# Altium project USB HUB 2.0.PrjPCB
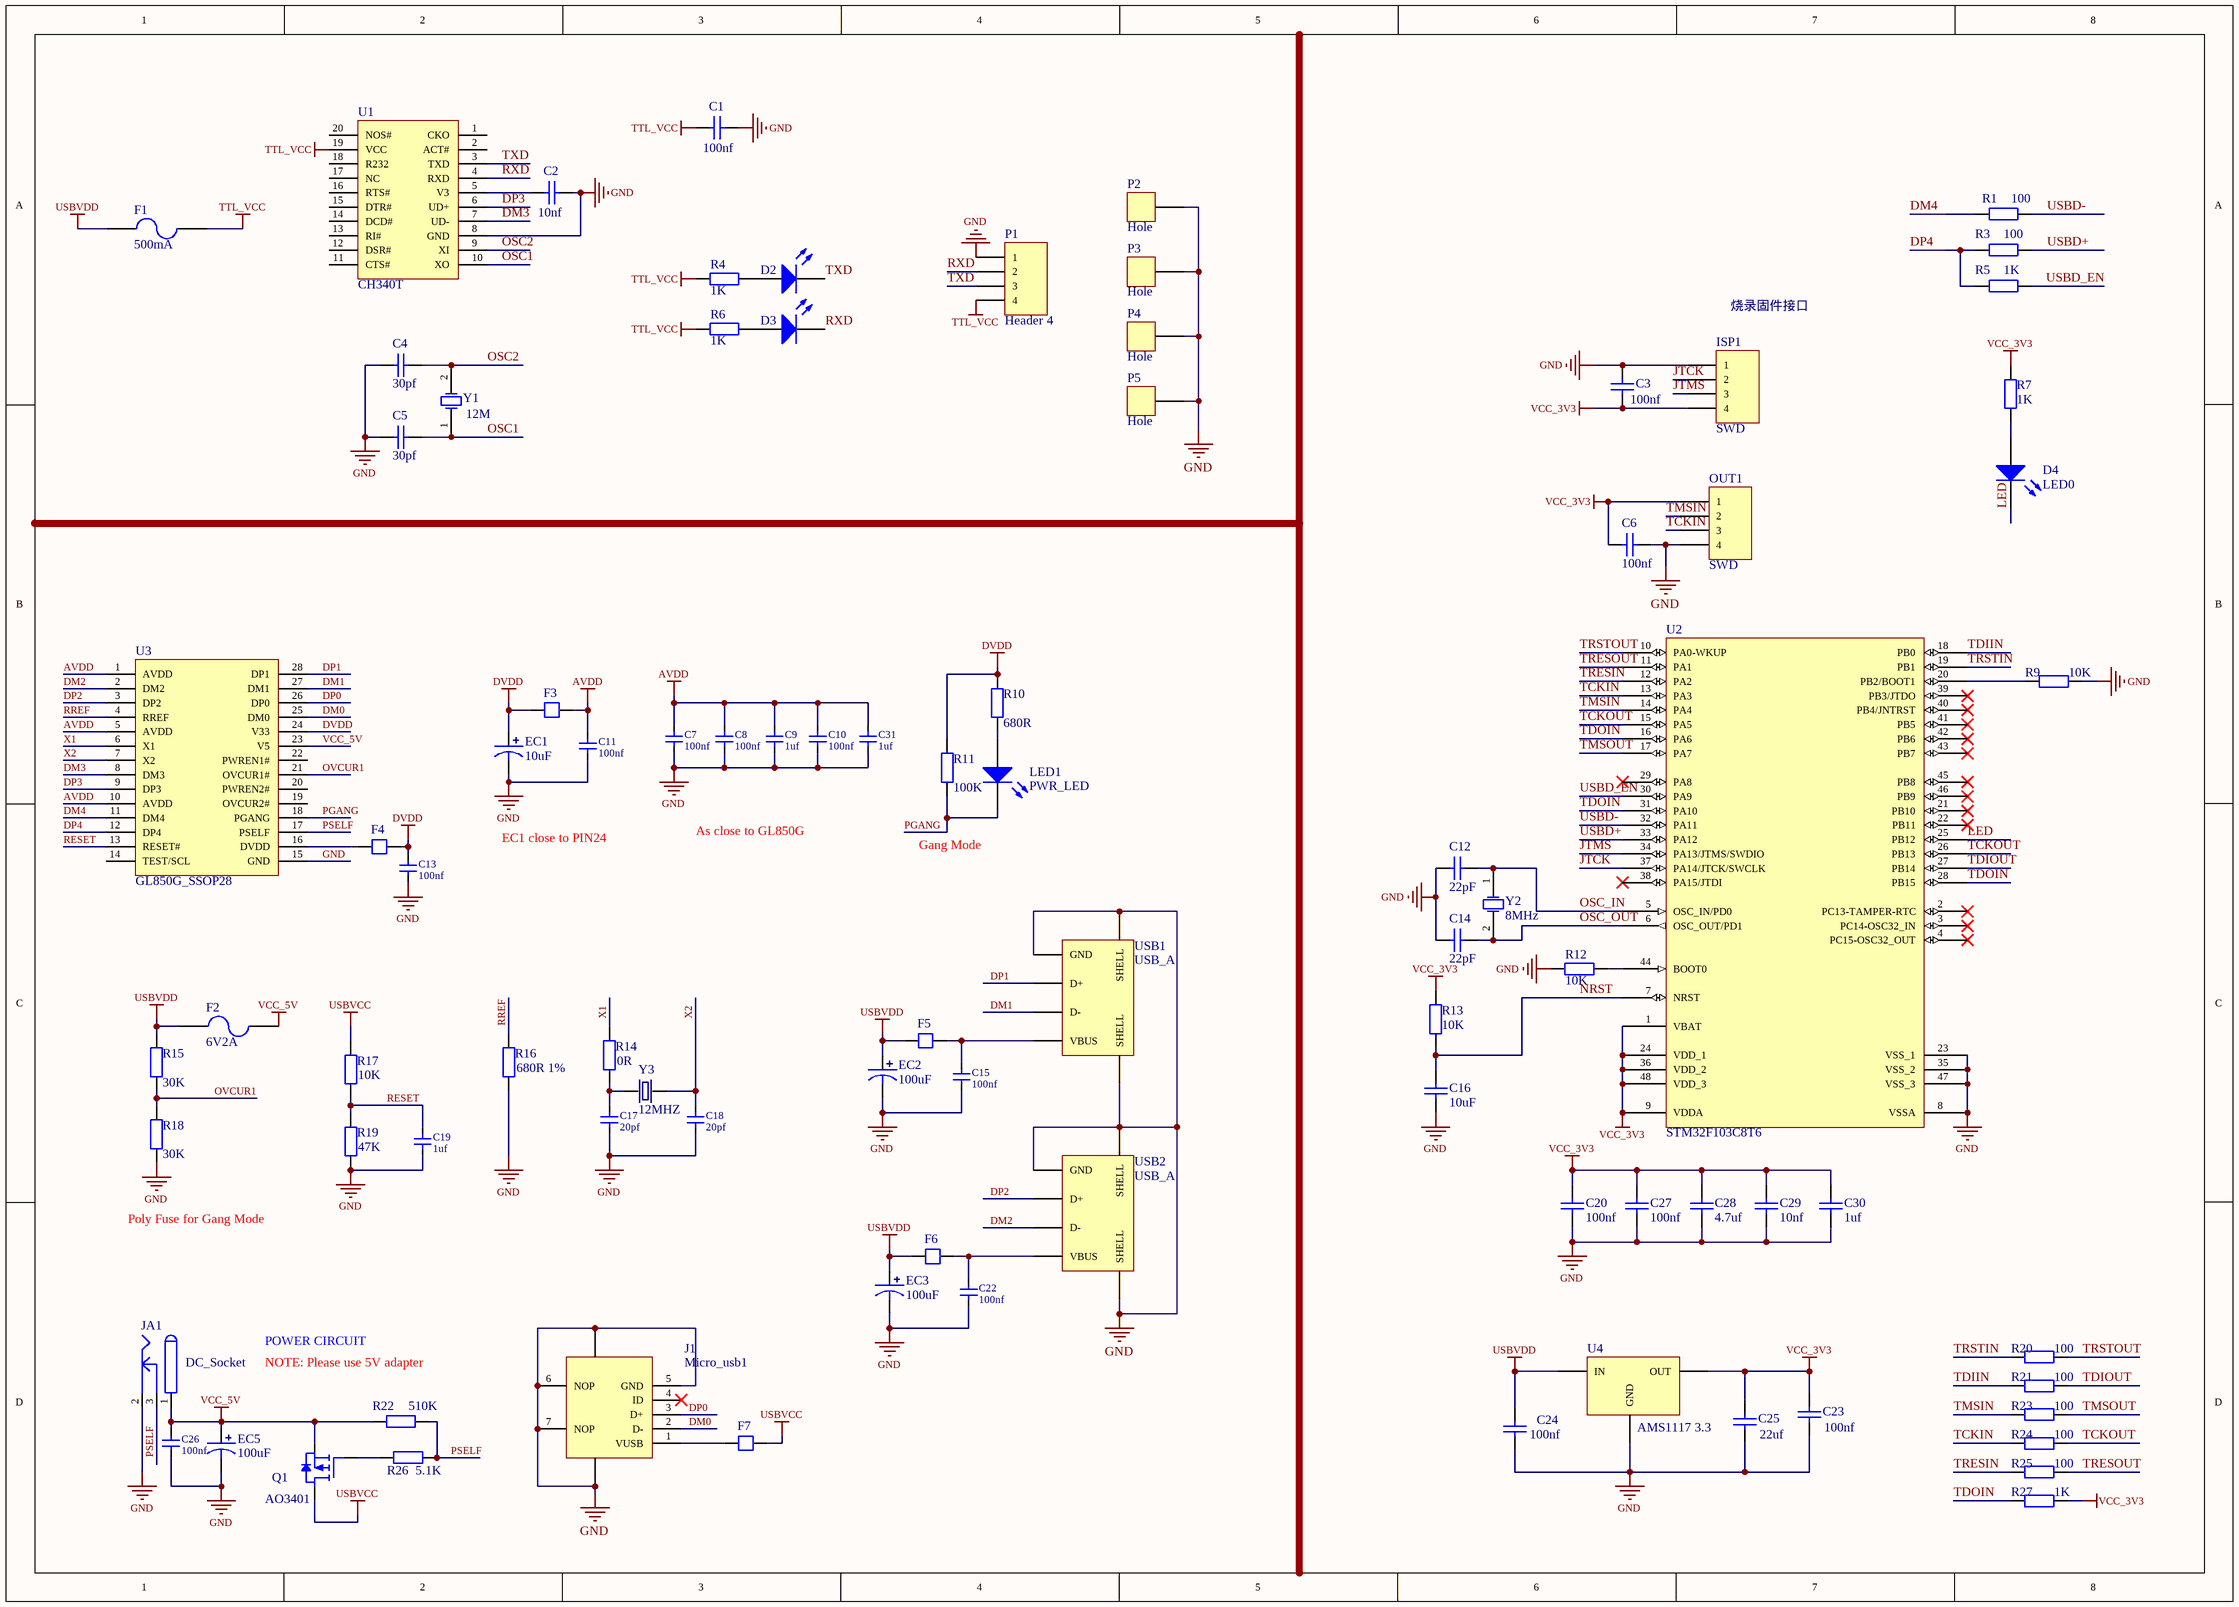
[diagram p0: USB HUB 2.0.SchDoc]
1 sheet, 89 parts. Net scope: global (net labels, ports and power ports of the same name join across sheets).
Board file: USB HUB 2.0.PcbDoc

## Sheet USB HUB 2.0.SchDoc: USB HUB 2.0
size A3; DocumentNumber: 1; Revision: V1.0; SheetNumber: 1; SheetTotal: 1; Size: 1000*700

### Parts
C1  value 100nf  [j1-0603]  (hidden comment: Cap)
C2  value 10nf  [j1-0603]  (hidden comment: Cap)
C3  value 100nf  [j1-0603]
C4  value 30pf  [j1-0603]  (hidden comment: Cap)
C5  value 30pf  [j1-0603]  (hidden comment: Cap)
C6  value 100nf  [j1-0603]
C7  100nf  [j1-0603]
C8  100nf  [j1-0603]
C9  1uf  [j1-0603]
C10  100nf  [j1-0603]
C11  100nf  [j1-0603]
C12  value 22pF  [j1-0603]
C13  100nf  [j1-0603]
C14  value 22pF  [j1-0603]
C15  100nf  [j1-0603]
C16  value 10uF  [j1-0603]
C17  20pf  [j1-0603]
C18  20pf  [j1-0603]
C19  1uf  [j1-0603]
C20  value 100nf  [j1-0603]
C22  100nf  [j1-0603]
C23  value 100nf  [j1-0603]
C24  value 100nf  [j1-0603]
C25  value 22uf  [j1-0603]
C26  100nf  [j1-0603]
C27  value 100nf  [j1-0603]
C28  value 4.7uf  [j1-0603]
C29  value 10nf  [j1-0603]
C30  value 1uf  [j1-0603]
C31  1uf  [j1-0603]
D2  LED  [j1-0603]  (value not drawn)
D3  LED  [j1-0603]  (value not drawn)
D4  LED0  [j1-0603]
EC1  10uF  [6-0805_L]
EC2  100uF  [SMD-EC5.0X5.3X5.4]
EC3  100uF  [SMD-EC5.0X5.3X5.4]
EC5  100uF  [SMD-EC5.0X5.3X5.4]
F1  500mA  [1812C]
F2  6V2A  [1812]
F3  FB  [6-0805_L]  (value not drawn)
F4  FB  [6-0805_L]  (value not drawn)
F5  FB  [6-0805_L]  (value not drawn)
F6  FB  [6-0805_L]  (value not drawn)
F7  FB  [6-0805_L]  (value not drawn)
ISP1  SWD  [HDR1X4]
J1  Micro_usb1  [Micro_USB1]
JA1  DC_Socket  [DC-002]
LED1  PWR_LED  [j1-0603]
OUT1  SWD  [HDR1X4]
P1  Header 4  [HDR1X4]
P2  Hole  [Hole]
P3  Hole  [Hole]
P4  Hole  [Hole]
P5  Hole  [Hole]
Q1  AO3401  [SOT-23]
R1  value 100  [j1-0603]
R3  value 100  [j1-0603]
R4  value 1K  [j1-0603]  (hidden comment: Res2)
R5  value 1K  [j1-0603]
R6  value 1K  [j1-0603]  (hidden comment: Res2)
R7  value 1K  [j1-0603]
R9  value 10K  [j1-0603]
R10  680R  [j1-0603]
R11  100K  [j1-0603]
R12  value 10K  [j1-0603]
R13  value 10K  [j1-0603]
R14  0R  [j1-0603]
R15  30K  [j1-0603]
R16  680R 1%  [j1-0603]
R17  10K  [j1-0603]
R18  30K  [j1-0603]
R19  47K  [j1-0603]
R20  value 100  [j1-0603]
R21  value 100  [j1-0603]
R22  510K  [j1-0603]
R23  value 100  [j1-0603]
R24  value 100  [j1-0603]
R25  value 100  [j1-0603]
R26  5.1K  [j1-0603]
R27  value 1K  [j1-0603]
U1  CH340T  [SSOP20]
U2  STM32F103C8T6  [LQFP48 7X7]
U3  GL850G_SSOP28  [SSOP28]
U4  AMS1117 3.3  [SOT-223]
USB1  USB_A  [USB_DIP]
USB2  USB_A  [USB_DIP]
Y1  12M  [HC-49/U-S]
Y2  8MHz  [HC-49/U-S]
Y3  12MHZ  [HC-49/U-S]

### Nets
AVDD: C7.2 C8.2 C9.2 C10.2 C11.2 C31.2 F3.2 U3.1(AVDD) U3.5(AVDD) U3.10(AVDD)
DVDD: C13.2 EC1.1 F3.1 F4.2 R10.2 R11.2 U3.24(V33)
GND: C1.1 C2.1 C3.2 C4.2 C5.2 C6.2 C7.1 C8.1 C9.1 C10.1 C11.1 C12.2 C13.1 C14.2 C15.1 C16.2 C17.1 C18.1 C19.1 C20.2 C22.1 C23.2 C24.2 C25.2 C26.1 C27.2 C28.2 C29.2 C30.2 C31.1 EC1.2 EC2.2 EC3.2 EC5.2 ISP1.1 J1.5(GND) J1.6(NOP) J1.7(NOP) J1.8 J1.9 JA1.2 OUT1.4 P1.1 P2.1 P3.1 P4.1 P5.1 R9.2 R12.1 R16.1 R18.1 R19.1 U1.8(GND) U2.8(VSSA) U2.23(VSS_1) U2.35(VSS_2) U2.47(VSS_3) U3.15(GND) U4.1(GND) USB1.4(GND) USB1.5(SHELL) USB1.6(SHELL) USB2.4(GND) USB2.5(SHELL) USB2.6(SHELL)
TTL_VCC: C1.2 F1.2 P1.4 R4.1 R6.1 U1.19(VCC)
USBVCC: F7.2 Q1.3(D) R17.2
USBVDD: C24.1 EC2.1 EC3.1 F1.1 F2.1 F5.1 F6.1 R15.2 U4.3(IN)
VCC_3V3: C3.1 C6.1 C20.1 C23.1 C25.1 C27.1 C28.1 C29.1 C30.1 ISP1.4 OUT1.1 R7.2 R13.2 R27.2 U2.1(VBAT) U2.9(VDDA) U2.24(VDD_1) U2.36(VDD_2) U2.48(VDD_3) U4.2(OUT)
VCC_5V: C26.2 EC5.1 F2.2 JA1.1 Q1.2(S) R22.2 U3.23(V5)
DM0: J1.2(D-) U3.25(DM0)
DM1: U3.27(DM1) USB1.2(D-)
DM2: U3.2(DM2) USB2.2(D-)
DM3: U1.7(UD-) U3.8(DM3)
DM4: R1.1 U3.11(DM4)
DP0: J1.3(D+) U3.26(DP0)
DP1: U3.28(DP1) USB1.3(D+)
DP2: U3.3(DP2) USB2.3(D+)
DP3: U1.6(UD+) U3.9(DP3)
DP4: R3.1 R5.1 U3.12(DP4)
JTCK: ISP1.2 U2.37(PA14/JTCK/SWCLK)
JTMS: ISP1.3 U2.34(PA13/JTMS/SWDIO)
LED: D4.2(K) U2.25(PB12)
NRST: C16.1 R13.1 U2.7(NRST)
OSC1: C5.1 U1.10(XO) Y1.1(OSC1)
OSC2: C4.1 U1.9(XI) Y1.2(OSC2)
OSC_IN: C12.1 U2.5(OSC_IN/PD0) Y2.1(OSC1)
OSC_OUT: C14.1 U2.6(OSC_OUT/PD1) Y2.2(OSC2)
OVCUR1: R15.1 R18.2 U3.21(OVCUR1#)
PGANG: LED1.2(K) R11.1 U3.18(PGANG)
PSELF: JA1.3 R22.1 R26.2 U3.17(PSELF)
RESET: C19.2 R17.1 R19.2 U3.13(RESET#)
RREF: R16.2 U3.4(RREF)
RXD: D3.2 P1.2 U1.4(RXD)
TCKIN: OUT1.3 R24.1 U2.13(PA3)
TCKOUT: R24.2 U2.15(PA5) U2.26(PB13)
TDIIN: R21.1 U2.18(PB0)
TDIOUT: R21.2 U2.27(PB14)
TDOIN: R27.1 U2.16(PA6) U2.28(PB15) U2.31(PA10)
TMSIN: OUT1.2 R23.1 U2.14(PA4)
TMSOUT: R23.2 U2.17(PA7)
TRESIN: R25.1 U2.12(PA2)
TRESOUT: R25.2 U2.11(PA1)
TRSTIN: R20.1 U2.19(PB1)
TRSTOUT: R20.2 U2.10(PA0-WKUP)
TXD: D2.2 P1.3 U1.3(TXD)
USBD+: R3.2 U2.33(PA12)
USBD-: R1.2 U2.32(PA11)
USBD_EN: R5.2 U2.30(PA9)
X1: R14.2 U3.6(X1)
X2: C18.2 U3.7(X2) Y3.2
NetC2_2: C2.2 U1.5(V3)
NetC15_2: C15.2 F5.2 USB1.1(VBUS)
NetC17_2: C17.2 R14.1 Y3.1
NetC22_2: C22.2 F6.2 USB2.1(VBUS)
NetD2_1: D2.1 R4.2
NetD3_1: D3.1 R6.2
NetD4_1: D4.1(A) R7.1
NetF4_1: F4.1 U3.16(DVDD)
NetF7_1: F7.1 J1.1(VUSB)
NetLED1_1: LED1.1(A) R10.1
NetQ1_1: Q1.1(G) R26.1
NetR9_1: R9.1 U2.20(PB2/BOOT1)
NetR12_2: R12.2 U2.44(BOOT0)

Not connected (* = marked no-connect by the designer): J1 4(ID)*; U1 1(CKO) 2(ACT#) 11(CTS#) 12(DSR#) 13(RI#) 14(DCD#) 15(DTR#) 16(RTS#) 17(NC) 18(R232) 20(NOS#); U2 2(PC13-TAMPER-RTC)* 3(PC14-OSC32_IN)* 4(PC15-OSC32_OUT)* 21(PB10)* 22(PB11)* 29(PA8)* 38(PA15/JTDI)* 39(PB3/JTDO)* 40(PB4/JNTRST)* 41(PB5)* 42(PB6)* 43(PB7)* 45(PB8)* 46(PB9)*; U3 14(TEST/SCL) 19(OVCUR2#) 20(PWREN2#) 22(PWREN1#)

### Notes on the sheet
- (near ISP1) 烧录固件接口
- As close to GL850G
- EC1 close to PIN24
- Gang Mode
- Poly Fuse for Gang Mode
- POWER CIRCUIT
- (near R22) NOTE: Please use 5V adapter
- Title:
- Size:
- Date:
- Number:
- Time:
- Revision:
- Sheet
- of
- File:

### Library data of the parts
C1-C20 C22-C31 = Cap: Capacitor
  C1 C2 C4 C5: Published: 8-Jun-2000; LatestRevisionDate: 17-Jul-2002; LatestRevisionNote: Re-released for DXP Platform.; Publisher: Altium Limited
  C3 C6 C12 C14 C16 C20 C23-C25 C27-C30: Published: 8-Jun-2000; LatestRevisionDate: 17-Jul-2002; LatestRevisionNote: Re-released for DXP Platform.; PackageReference: RAD-0.3; Publisher: Altium Limited
D2-D4 LED1 = LED0: Typical INFRARED GaAs LED; Published: 8-Jun-2000; LatestRevisionDate: 08-Jul-2005; LatestRevisionNote: Mech Layer 1 removed.; PackageReference: LED-0; Publisher: Altium Limited
  D4 LED1: PackageDescription: LED; 2 Leads
EC1-EC3 EC5 = SMD_ECAP: 贴片电解电容
F1 F2 = Fuse 2: Fuse; Published: 8-Jun-2000; LatestRevisionDate: 17-Jul-2002; LatestRevisionNote: Re-released for DXP Platform.; PackageReference: PIN-W2/E2.8; Publisher: Altium Limited; PackageDescription: Thru-Hole; 2 Leads
ISP1 OUT1 P1 = Header 4: Header, 4-Pin; LatestRevisionDate: 17-Jul-2002; LatestRevisionNote: Re-released for DXP Platform.; Publisher: Altium Limited
Q1 = MOSFET-P: P-Channel MOSFET
R1 R3-R7 R9-R27 = Res2: Resistor; Published: 8-Jun-2000; LatestRevisionDate: 17-Jul-2002; LatestRevisionNote: Re-released for DXP Platform.; PackageReference: AXIAL-0.4; Publisher: Altium Limited
  R10: PackageDescription: Axial Device, Thru-Hole; 2 Leads; 0.4 in Pin Spacing; Value: 680R
  R11: PackageDescription: Axial Device, Thru-Hole; 2 Leads; 0.4 in Pin Spacing; Value: 100K
  R14: PackageDescription: Axial Device, Thru-Hole; 2 Leads; 0.4 in Pin Spacing; Value: 0R
  R15 R18: PackageDescription: Axial Device, Thru-Hole; 2 Leads; 0.4 in Pin Spacing; Value: 30K
  R16: PackageDescription: Axial Device, Thru-Hole; 2 Leads; 0.4 in Pin Spacing; Value: 680R 1%
  R17: PackageDescription: Axial Device, Thru-Hole; 2 Leads; 0.4 in Pin Spacing; Value: 10K
  R19: PackageDescription: Axial Device, Thru-Hole; 2 Leads; 0.4 in Pin Spacing; Value: 47K
  R22: PackageDescription: Axial Device, Thru-Hole; 2 Leads; 0.4 in Pin Spacing; Value: 510K
  R26: PackageDescription: Axial Device, Thru-Hole; 2 Leads; 0.4 in Pin Spacing; Value: 5.1K
U4 = ASM1117
Y1 = Xtal: Crystal Oscillator; Published: 8-Jun-2000; LatestRevisionDate: 17-Jul-2002; LatestRevisionNote: Re-released for DXP Platform.; PackageReference: R38; Publisher: Altium Limited
Y2 = XTAL: Crystal Oscillator; Published: 8-Jun-2000; LatestRevisionDate: 17-Jul-2002; LatestRevisionNote: Re-released for DXP Platform.; PackageReference: R38; Publisher: Altium Limited
Y3 = Xtal